# Altium project Omega Blade PCB and Schematic.PrjPcb
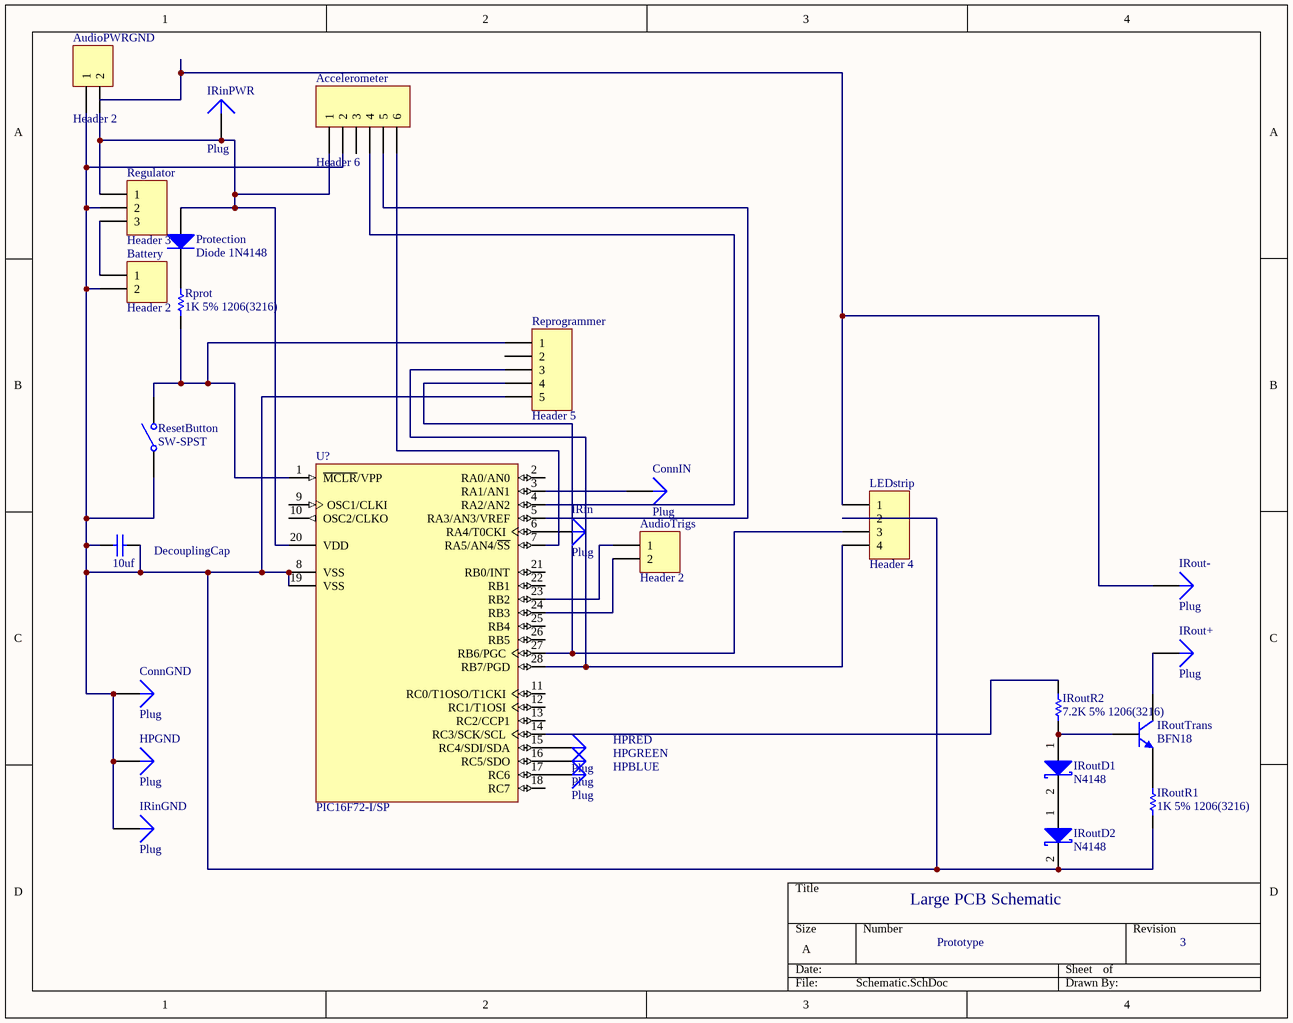
[diagram p0: Schematic.SchDoc]
1 sheet, 28 parts. Net scope: global (net labels, ports and power ports of the same name join across sheets).
Board file: PCB1.PcbDoc

## Sheet Schematic.SchDoc
size A

### Parts
Accelerometer  Header 6  [HDR1X6]
AudioPWRGND  Header 2  [HDR1X2]
AudioTrigs  Header 2  [HDR1X2]
Battery  Header 2  [HDR1X2]
ConnGND  Plug  [PIN1]
ConnIN  Plug  [PIN1]
DecouplingCap  10uf  [CAPC0805(2012)75_L]
HPBLUE  Plug  [PIN1]
HPGND  Plug  [PIN1]
HPGREEN  Plug  [PIN1]
HPRED  Plug  [PIN1]
IRin  Plug  [PIN1]
IRinGND  Plug  [PIN1]
IRinPWR  Plug  [PIN1]
IRout+  Plug  [PIN1]
IRout-  Plug  [PIN1]
IRoutD1  N4148  [DIOD-SOD323-2_V]
IRoutD2  N4148  [DIOD-SOD323-2_V]
IRoutR1  1K 5% 1206(3216)  [RESC1206(3216)_N]
IRoutR2  7.2K 5% 1206(3216)  [RESC1206(3216)_N]
IRoutTrans  BFN18  [INF-SOT89_SC-62_M]
LEDstrip  Header 4  [HDR1X4]
Protection  Diode 1N4148  [DO-35]
Regulator  Header 3  [HDR1X3]
Reprogrammer  Header 5  [HDR1X5]
ResetButton  SW-SPST  [SPST-2]
Rprot  1K 5% 1206(3216)  [RESC1206(3216)_N]
U?  PIC16F72-I/SP  [SPDIP300-SP28]

### Nets
NetAccelerometer_1: Accelerometer.1 AudioPWRGND.2 IRinPWR.1 Protection.1(A) Regulator.1 U?.20(VDD)
NetAccelerometer_2: Accelerometer.2 AudioPWRGND.1 Battery.2 ConnGND.1 DecouplingCap.1 DecouplingCap.2 HPGND.1 IRinGND.1 IRoutD2.2(K) IRoutR1.1 LEDstrip.2 Regulator.2 Reprogrammer.5 ResetButton.1(COMMON) U?.8(VSS) U?.19(VSS)
NetAccelerometer_4: Accelerometer.4 U?.4(RA2/AN2)
NetAccelerometer_5: Accelerometer.5 U?.5(RA3/AN3/VREF)
NetAccelerometer_6: Accelerometer.6 U?.7(RA5/AN4/~{SS})
NetAudioTrigs_1: AudioTrigs.1 U?.23(RB2)
NetAudioTrigs_2: AudioTrigs.2 U?.24(RB3)
NetBattery_1: Battery.1 Regulator.3
NetConnIN_1: ConnIN.1 U?.3(RA1/AN1)
NetHPBLUE_1: HPBLUE.1 U?.17(RC6)
NetHPGREEN_1: HPGREEN.1 U?.16(RC5/SDO)
NetHPRED_1: HPRED.1 U?.15(RC4/SDI/SDA)
NetIRin_1: IRin.1 U?.6(RA4/T0CKI)
NetIRout+_1: IRout+.1 IRoutTrans.2(C)
NetIRout-_1: IRout-.1 LEDstrip.1
NetIRoutD1_1: IRoutD1.1(A) IRoutR2.1 IRoutTrans.1(B)
NetIRoutD1_2: IRoutD1.2(K) IRoutD2.1(A)
NetIRoutR1_2: IRoutR1.2 IRoutTrans.3(E)
NetIRoutR2_2: IRoutR2.2 U?.14(RC3/SCK/SCL)
NetLEDstrip_3: LEDstrip.3 Reprogrammer.4 U?.27(RB6/PGC)
NetLEDstrip_4: LEDstrip.4 Reprogrammer.3 U?.28(RB7/PGD)
NetProtection_2: Protection.2(K) Rprot.2
NetReprogrammer_1: Reprogrammer.1 ResetButton.2(NO) Rprot.1 U?.1(~{MCLR}/VPP)

Not connected (* = marked no-connect by the designer): Accelerometer 3; Reprogrammer 2; U? 2(RA0/AN0) 9(OSC1/CLKI) 10(OSC2/CLKO) 11(RC0/T1OSO/T1CKI) 12(RC1/T1OSI) 13(RC2/CCP1) 18(RC7) 21(RB0/INT) 22(RB1) 25(RB4) 26(RB5)

### Notes on the sheet
- (near IRoutD2) Large PCB Schematic
- Prototype
- 3

### Library data of the parts
Accelerometer = Header 6: Header, 6-Pin; LatestRevisionDate: 17-Jul-2002; LatestRevisionNote: Re-released for DXP Platform.; Publisher: Altium Limited
AudioPWRGND AudioTrigs Battery = Header 2: Header, 2-Pin; LatestRevisionDate: 17-Jul-2002; LatestRevisionNote: Re-released for DXP Platform.; Publisher: Altium Limited
DecouplingCap = CMP-1036-01219-1: CAP 22pF 16V Â±5% 0805 (2012 Metric) Thickness 0.75mm SMD; Case-Metric: 2012; Case-EIA: 0805; Technology: SMT; Max Thickness: 0.75 mm; Value: 22pF; Tolerance: Â±5%; Rated Voltage: 16 V
IRoutD1 IRoutD2 = CMP-0303-00001-1: Schottky Diode, 400mA; PartNumber: ZHCS400; Manufacturer: Diodes Inc; Reverse Voltage: 40 V; Power Dissipation: 250 mW; Reverse Current: 40 uA@Vr=30 V; Packing Type: Tape and Reel; Forward Voltage: 425 mV@If=400 mA; ComponentLink3URL: http://www.diodes.com/datasheets/ap02002.pdf; Moisture Sensitivity Level: 1; ComponentLink2URL: http://www.diodes.com/datasheets/ZHCS400.pdf; PackageDescription: 2-Pin SMT Diode, 1.7 x 1.3 mm Body; ComponentLink2Description: Datasheet; PackageReference: SOD323; ComponentLink1Description: Manufacturer URL; Mounting Technology: Surface Mount; DatasheetVersion: Rev. 8-2, 03/2012; ComponentLink1URL: http://www.diodes.com/; Storage Temperature: -55 to 150 degC; ComponentLink3Description: Package Specification; PackageVersion: Rev. 73
IRoutR1 IRoutR2 Rprot = CMP-1014-00074-1: 1K 0.25W 5% 1206 (3216 Metric)  SMD; Value: 1000.00 Ohm; Case-Metric: 3216; Case-EIA: 1206; Tolerance: 5 %; Power: 0.25 W; Technology: SMT
IRoutTrans = CMP-1197-00012-1: NPN Silicon High-Voltage Transistor, 300 V VCEO, 30 mA IC, SOT89, Reel, Green; Manufacturer: Infineon; ICM (max): 500Â mA; ICBO (max): 100Â nA; VEBO (max): 5Â V; VCE: 10Â V; VCBO (max): 300Â V; hFE (min): 30; IC (max): 30Â mA; Green: TRUE; fT (typ): 70Â MHz; ComponentLink3URL: http://www.infineon.com/dgdl/SOT89-Package_Overview.pdf?folderId=db3a30431936bc4b01195371b8363cff&fileId=db3a30431936bc4b0119537ed61d3d22; DatasheetVersion: Rev. 1.0; ComponentLink2URL: http://www.infineon.com/dgdl/bfn18.pdf?folderId=db3a30431441fb5d011449af3ad90232&fileId=db3a30431441fb5d011449b188060234; ComponentLink1Description: Manufacturer URL; VCE (max): 10Â V; Mounting Technology: Surface Mount; ComponentLink1URL: http://www.infineon.com/; Packing: Reel; Polarity: NPN; PackageDescription: 3-Pin Small Outline Transistor Package, 4.5 x 2.5 mm Body, 1.5 mm Pitch; ComponentLink3Description: Package Specification; ComponentLink2Description: Datasheet; PartNumber: BFN18; PackageVersion: Apr-08; PackageReference: SOT89 (SC-62); IC: 30Â mA; VCEO (max): 300Â V
LEDstrip = Header 4: Header, 4-Pin; LatestRevisionDate: 17-Jul-2002; LatestRevisionNote: Re-released for DXP Platform.; Publisher: Altium Limited
Protection = Diode 1N4148: High Conductance Fast Diode; Published: 8-Jun-2000; LatestRevisionDate: 17-Jul-2002; LatestRevisionNote: Re-released for DXP Platform.; DatasheetVersion: 1997; PackageReference: DO-35; Publisher: Altium Limited; PackageDescription: Diode, Axial; Body 3.8 x 1.9 mm (LxDia. max), Lead Dia. 0.53 mm (max); Code_JEDEC: DO-204-AH; ComponentLink1Description: Manufacturer Link; ComponentLink1URL: http://www.fairchildsemi.com/; ComponentLink2Description: Datasheet; ComponentLink2URL: http://www.fairchildsemi.com/ds/1N%2F1N4148.pdf
Regulator = Header 3: Header, 3-Pin; LatestRevisionDate: 17-Jul-2002; LatestRevisionNote: Re-released for DXP Platform.; Publisher: Altium Limited
Reprogrammer = Header 5: Header, 5-Pin; LatestRevisionDate: 17-Jul-2002; LatestRevisionNote: Re-released for DXP Platform.; Publisher: Altium Limited
ResetButton = SW-SPST: Single-Pole, Single-Throw Switch; Published: 24-Mar-1999; LatestRevisionDate: 17-Jul-2002; LatestRevisionNote: Re-released for DXP Platform.; PackageReference: SPST-2; Publisher: Altium Limited; PackageDescription: Switch; 2 Leads
U? = PIC16F72-I/SP: 8-Bit CMOS FLASH Microcontroller with A/D Converter, 2K (x14-Bit words) FLASH, 128 Bytes RAM, 28-Pin PDIP 300mil, Standard VDD Range, Industrial Temperature; Published: 11-Oct-2004; LatestRevisionDate: 29-Jan-2009; LatestRevisionNote: Sch. layout revised. 3D Model Removed.; DatasheetVersion: revC, Jan-2007; PackageVersion: revBB, Aug-2009; PackageReference: SPDIP300-SP28; Publisher: Altium Limited; PackageDescription: 28-Lead Skinny Plastic Dual In-Line (SP) - 300 mil Body [SPDIP]; Supplier 1: Digi-Key; Supplier Part Number 1: PIC16F72-I/SP-ND; Supplier 2: Farnell; Supplier Part Number 2: 9760636; ComponentLink1Description: Datasheet; ComponentLink1URL: http://ww1.microchip.com/downloads/en/DeviceDoc/39597C.pdf; ComponentLink2Description: Packaging Specification; ComponentLink2URL: http://www.microchip.com/stellent/groups/techpub_sg/documents/packagingspec/en012702.pdf; ComponentLink3Description: Microchip.com Home; ComponentLink3URL: http://www.microchip.com/
ConnGND ConnIN HPBLUE HPGND HPGREEN HPRED IRin IRinGND IRinPWR IRout+ IRout- = Plug: LatestRevisionDate: 17-Jul-2002; LatestRevisionNote: Re-released for DXP Platform.; Publisher: Altium Limited